# Altium schematic sheet [07] - TRANSCEIVERS.SchDoc
size A4
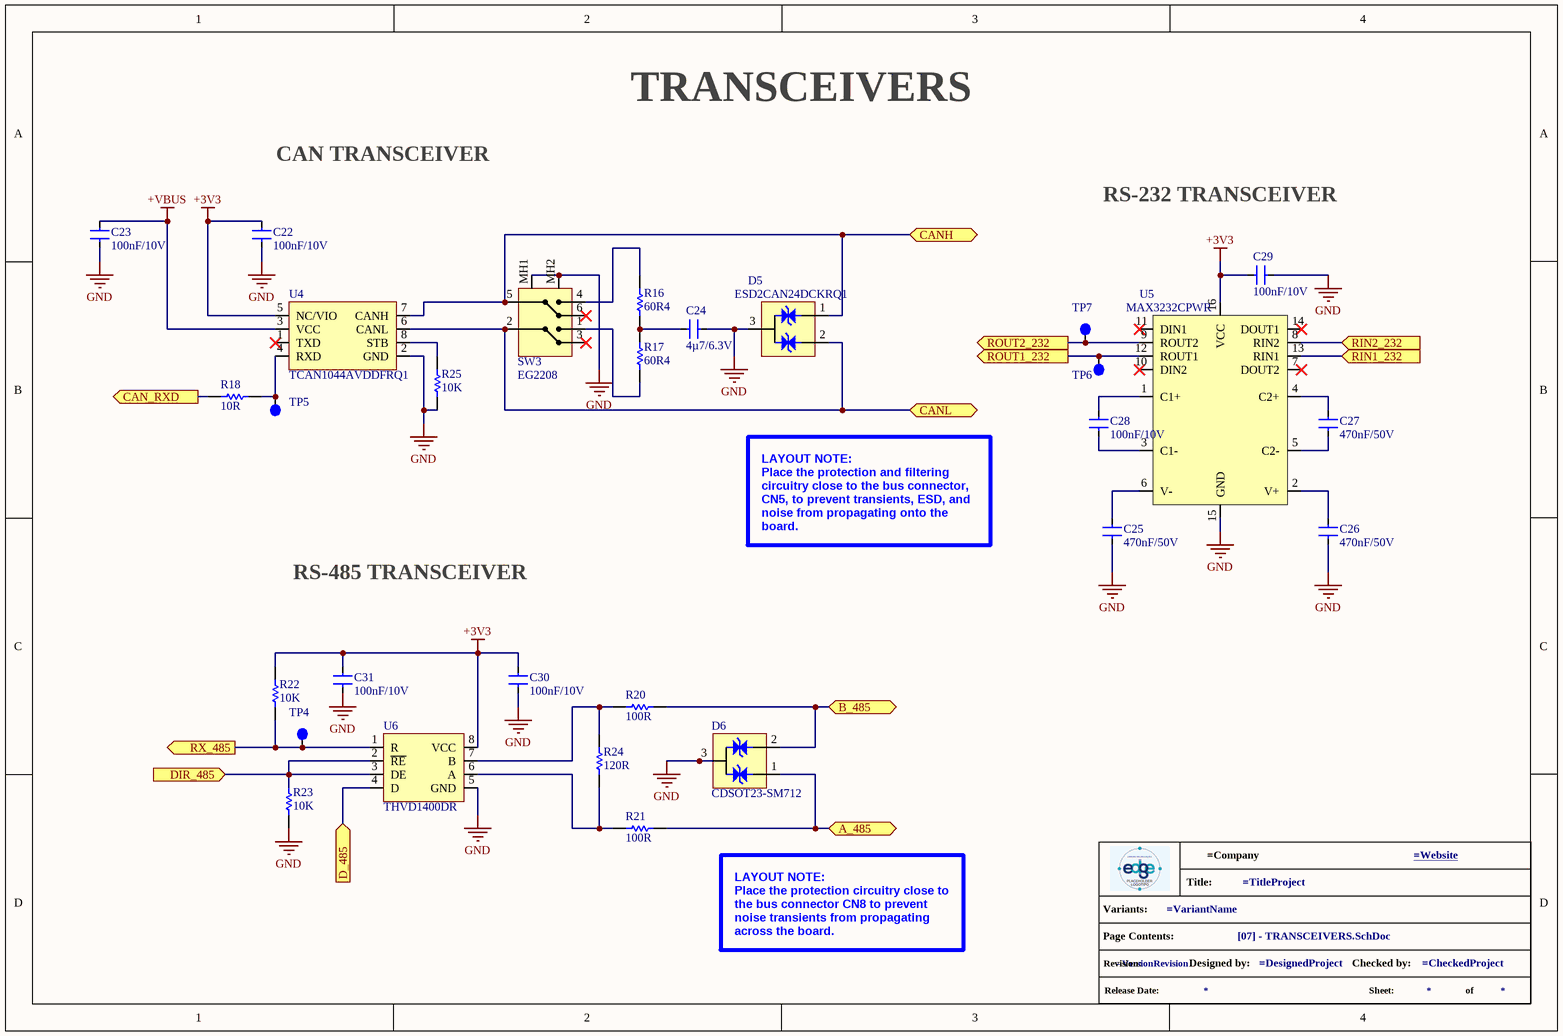
[diagram p0: [07] - TRANSCEIVERS.SchDoc]

## Parts
C22  100nF/10V  [C0402]
C23  100nF/10V  [C0402]
C24  4µ7/6.3V  [C0402]
C25  470nF/50V  [C0402]
C26  470nF/50V  [C0402]
C27  470nF/50V  [C0402]
C28  100nF/10V  [C0402]
C29  100nF/10V  [C0402]
C30  100nF/10V  [C0402]
C31  100nF/10V  [C0402]
D5  ESD2CAN24DCKRQ1  [ESD2CAN24DCKRQ1]
D6  CDSOT23-SM712  [CDSOT23-SM712]
GPH?  info_project  (value not drawn)  (graphical)
R16  60R4  [R0402]
R17  60R4  [R0402]
R18  10R  [R0402]
R20  100R  [R0603]
R21  100R  [R0603]
R22  10K  [R0402]
R23  10K  [R0402]
R24  120R  [R0402]
R25  10K  [R0402]
SW3  EG2208  [EG2208]
TP4  TestPoint  [Test Point]  (value not drawn)  (no BOM)
TP5  TestPoint  [Test Point]  (value not drawn)  (no BOM)
TP6  TestPoint  [Test Point]  (value not drawn)  (no BOM)
TP7  TestPoint  [Test Point]  (value not drawn)  (no BOM)
U4  TCAN1044AVDDFRQ1  [TCAN1044AVDDFRQ1]
U5  MAX3232CPWR  [MAX3232CPWR]
U6  THVD1400DR  [THVD1400DR]

## Ports
A_485 (bidir), B_485 (bidir), CAN_RXD (out), CANH (bidir), CANL (bidir), D_485 (in), DIR_485 (in), RIN1_232 (in), RIN2_232 (in), ROUT1_232 (out), ROUT2_232 (out), RX_485 (out)

## Nets
+3V3: C22.1 C29.2 C30.2 C31.2 R22.2 U4.5(NC/VIO) U5.16(VCC) U6.8(VCC)
+VBUS: C23.1 U4.3(VCC)
GND: C22.2 C23.2 C24.2 C25.1 C26.1 C29.1 C30.1 C31.1 D5.3(GND) D6.3(GND) R23.1 R25.1 SW3.MH1 SW3.MH2 U4.2(GND) U5.15(GND) U6.5(GND)
A_485: D6.1(IO_1) R21.2 ; port A_485
B_485: D6.2(IO_2) R20.2 ; port B_485
CAN_RXD: R18.1 ; port CAN_RXD
CANH: D5.1(IO_1) SW3.5(COM_2) U4.7(CANH) ; port CANH
CANL: D5.2(IO_2) SW3.2(COM_1) U4.6(CANL) ; port CANL
D_485: U6.4(D) ; port D_485
DIR_485: R23.2 U6.2(~{RE}) U6.3(DE) ; port DIR_485
RIN1_232: U5.13(RIN1) ; port RIN1_232
RIN2_232: U5.8(RIN2) ; port RIN2_232
ROUT1_232: TP6.1 U5.12(ROUT1) ; port ROUT1_232
ROUT2_232: TP7.1 U5.9(ROUT2) ; port ROUT2_232
RX_485: R22.1 TP4.1 U6.1(R) ; port RX_485
NetC24_1: C24.1 R16.1 R17.2
NetC25_2: C25.2 U5.6(V-)
NetC26_2: C26.2 U5.2(V+)
NetC27_1: C27.1 U5.5(C2-)
NetC27_2: C27.2 U5.4(C2+)
NetC28_1: C28.1 U5.3(C1-)
NetC28_2: C28.2 U5.1(C1+)
NetR16_2: R16.2 SW3.4
NetR17_1: R17.1 SW3.1
NetR18_2: R18.2 TP5.1 U4.4(RXD)
NetR20_1: R20.1 R24.2 U6.7(B)
NetR21_1: R21.1 R24.1 U6.6(A)
NetR25_2: R25.2 U4.8(STB)

Not connected (* = marked no-connect by the designer): SW3 3* 6*; U4 1(TXD)*; U5 7(DOUT2)* 10(DIN2)* 11(DIN1)* 14(DOUT1)*

## Notes on the sheet
- TRANSCEIVERS
- CAN TRANSCEIVER
- RS-232 TRANSCEIVER
- RS-485 TRANSCEIVER
- LAYOUT NOTE:
  Place the protection and filtering circuitry close to the bus connector, CN5, to prevent transients, ESD, and noise from propagating onto the board.
- LAYOUT NOTE:
  Place the protection circuitry close to the bus connector CN8 to prevent noise transients from propagating across the board.
- (in symbol info_project) Title:; Variants:; Page Contents:; Revision:; Designed by:; Checked by:; Release Date:; Sheet:; of

## Library data of the parts
C22 C23 C28-C31 = CL05B104KP5NNNC: MLCC - 100nF 10V X7R 0402 ±10% Ceramic Capacitor; Manufacturer 1: Samsung; Multilayer: Yes; .Mounting: SMT; Supplier: Digikey; Supplier Part Number: 1276-1002-1-ND; RoHS: Yes; Category: Ceramic Capacitors; Stock: 29591550; Pricing: 1=0,08, 10=0,004, 100=0,0036, 1000=0,0032 (USD); Mounting Technology: Surface Mount; Pins: 2; Dielectric Material: Ceramic; Package Shape: Rectangular; Case/Package: 0402; Terminal Finish: Nickel; Min Operating Temperature: -55°C; Max Operating Temperature: 125°C; JESD-609 Code: e3; Value: 100nF; Capacitor Type: Ceramic; Tolerance  (fill in as +-): 10%; Package Style: SMTMeter; Packaging: Tape and Reel; Tolerance (fill in as +-): 10%; Rated DC Voltage (URdc): 10V; Temperature Characteristics Code: X7R; Termination: Wraparound; Length: 1mm; Width: 0.5mm; Height: 0.5mm; Reach SVHC Compliant: Yes; RoHS Compliant: Yes; ComponentLink1URL: https://datasheet.ciiva.com:443/pdfs/VipMasterIC/IC/SEMS/SEMS-S-A0008523115/SEMS-S-A0008523129-1.pdf?src-supplier=IHS+Markit; ComponentLink1Description: https://datasheet.ciiva.com:443/pdfs/VipMasterIC/IC/SEMS/SEMS-S-A0008523115/SEMS-S-A0008523129-1.pdf?src-supplier=IHS+Markit; ComponentLink2URL: https://datasheet.ciiva.com/15165/getdatasheetpartid-37100-15165107.pdf?src-supplier=Verical; ComponentLink2Description: https://datasheet.ciiva.com/15165/getdatasheetpartid-37100-15165107.pdf?src-supplier=Verical; ComponentLink3URL: https://datasheet.ciiva.com/16498/cl05b104kq5nnnc-16498491.pdf?src-supplier=Future+Electronics; ComponentLink3Description: https://datasheet.ciiva.com/16498/cl05b104kq5nnnc-16498491.pdf?src-supplier=Future+Electronics; .PCBChecked: *; .SCHChecked: *; Manufacturer Part Number 1: CL05B104KP5NNNC
C24 = CL05A475KQ5NRNC: MLCC - 4.7 µF 6.3V 0402 X5R ±10%  Ceramic Capacitor X5R; Manufacturer 1: Samsung; Value: 4.7uF; Multilayer: Yes; .Mounting: SMT; Supplier: Digikey; Supplier Part Number: 1276-1481-1-ND; RoHS: Yes; Category: Ceramic Capacitors; Stock: 761086; Pricing: 1=0,08, 10=0,026, 100=0,016, 1000=0,0112, 2500=0,0096 (USD); Mounting Technology: Surface Mount; Pins: 2; Dielectric Material: Ceramic; Package Shape: Rectangular; Case/Package: 0402; Terminal Finish: Nickel; Min Operating Temperature: -55°C; Max Operating Temperature: 85°C; JESD-609 Code: e3; Capacitor Type: Ceramic; Tolerance  (fill in as +-): 10%; Packaging: Tape and Reel; Tolerance (fill in as +-): 10%; Rated DC Voltage (URdc): 6.3V; Temperature Characteristics Code: X5R; Termination: Wraparound; Reach SVHC Compliant: Yes; RoHS Compliant: Yes; ComponentLink1URL: https://datasheet.ciiva.com:443/pdfs/VipMasterIC/IC/SEMS/SEMS-S-A0008521219/SEMS-S-A0008521124-1.pdf?src-supplier=IHS+Markit; ComponentLink1Description: https://datasheet.ciiva.com:443/pdfs/VipMasterIC/IC/SEMS/SEMS-S-A0008521219/SEMS-S-A0008521124-1.pdf?src-supplier=IHS+Markit; ComponentLink2URL: https://datasheet.ciiva.com/25793/cl05a475kq5nrnc-25793634.pdf?src-supplier=Digikey; ComponentLink2Description: https://datasheet.ciiva.com/25793/cl05a475kq5nrnc-25793634.pdf?src-supplier=Digikey; ComponentLink3URL: https://datasheet.ciiva.com/26838/getdatasheetpartid-353228-26838196.pdf?src-supplier=Verical; ComponentLink3Description: https://datasheet.ciiva.com/26838/getdatasheetpartid-353228-26838196.pdf?src-supplier=Verical; .PCBChecked: *; .SCHChecked: *; Manufacturer Part Number 1: CL05A475KQ5NRNC
C25-C27 = GRM155R61H474KE11D: MLCC - 480nF 50V X5R 0402  ±10%  Ceramic Capacitor; Manufacturer 1: Murata; Value: 470nF; Multilayer: Yes; .Mounting: SMT; Supplier: Digikey; Supplier Part Number: 490-16354-1-ND; RoHS: Yes; Category: Ceramic Capacitors; Stock: 147570; Pricing: 1=0,1, 10=0,051, 100=0,0304, 1000=0,01969, 2500=0,01739, 5000=0,01546 (USD); Mounting Technology: Surface Mount; Pins: 2; Dielectric Material: Ceramic; Package Shape: Rectangular; Case/Package: 0402; Terminal Finish: Tin; Min Operating Temperature: -55°C; Max Operating Temperature: 85°C; JESD-609 Code: e3; Capacitor Type: Ceramic; Tolerance  (fill in as +-): 10%; Packaging: Tape and Reel; Tolerance (fill in as +-): 10%; Rated DC Voltage (URdc): 50V; Temperature Characteristics Code: X5R; Termination: Wraparound; Reach SVHC Compliant: Yes; RoHS Compliant: Yes; ComponentLink1URL: https://datasheet.ciiva.com:443/pdfs/VipMasterIC/IC/MURE/MURE-S-A0004362469/MURE-S-A0004364779-1.pdf?src-supplier=IHS+Markit; ComponentLink1Description: https://datasheet.ciiva.com:443/pdfs/VipMasterIC/IC/MURE/MURE-S-A0004362469/MURE-S-A0004364779-1.pdf?src-supplier=IHS+Markit; ComponentLink2URL: http://search.murata.co.jp/Ceramy/image/img/A01X/G101/ENG/GRM155R61H474KE11-01.pdf?src-supplier=Digikey; ComponentLink2Description: http://search.murata.co.jp/Ceramy/image/img/A01X/G101/ENG/GRM155R61H474KE11-01.pdf?src-supplier=Digikey; ComponentLink3URL: https://datasheet.octopart.com/GRM155R61H474KE11D-Murata-datasheet-99353828.pdf?src-supplier=Future+Electronics; ComponentLink3Description: https://datasheet.octopart.com/GRM155R61H474KE11D-Murata-datasheet-99353828.pdf?src-supplier=Future+Electronics; .PCBChecked: *; .SCHChecked: *; Manufacturer Part Number 1: GRM155R61H474KE11D
D5 = ESD2CAN24DCKRQ1: DIODE - TVS CLAMP - 37V (Typ) Clamp 5.7A (8/20µs) Ipp Tvs Diode Surface Mount SC-70-3; Manufacturer 1: Texas Instruments; .Mounting: SMT; Datasheet Link: https://www.ti.com/lit/ds/symlink/esd2can24-q1.pdf?ts=1669637432096&ref_url=https%253A%252F%252Fwww.ti.com%252Fproduct%252FESD2CAN24-Q1; Height: 1.1mm; Mouser Part Number: 595-ESD2CAN24DCKRQ1; Mouser Price/Stock: https://www.mouser.co.uk/ProductDetail/Texas-Instruments/ESD2CAN24DCKRQ1?qs=Y0Uzf4wQF3mF7ctB4rszMA%3D%3D; Arrow Part Number: ESD2CAN24DCKRQ1; Arrow Price/Stock: https://www.arrow.com/en/products/esd2can24dckrq1/texas-instruments?utm_currency=USD&region=nac; .PCBChecked: *; .SCHChecked: *; Manufacturer Part Number 1: ESD2CAN24DCKRQ1
D6 = CDSOT23-SM712: DIODE - TVS CLAMP 26V, 14V Clamp 17A (8/20µs) Ipp Tvs Diode Surface Mount SOT-23-3; Manufacturer 1: Bourns; .Mounting: SMT; Datasheet Link: http://uk.rs-online.com/web/p/products/7673728; Height: 1.17mm; Mouser Part Number: 652-CDSOT23-SM712; Mouser Price/Stock: https://www.mouser.co.uk/ProductDetail/Bourns/CDSOT23-SM712?qs=FuI%252BOVLl4%2FLTY%2FGQ265RLA%3D%3D; Arrow Part Number: CDSOT23-SM712; Arrow Price/Stock: https://www.arrow.com/en/products/cdsot23-sm712/bourns?utm_currency=USD&region=nac; .PCBChecked: *; .SCHChecked: *; Manufacturer Part Number 1: CDSOT23-SM712
GPH? = info_project: GRAPHICAL - Info Project
R16 R17 = ERJ-2RKF60R4X: RES - 60R4  1/10W 0402  ±1%  Chip Resistor; Manufacturer 1: Panasonic; Power: 100mW; Rated Temperature: 70°C; Value: 60.4R; Working Voltage: 50V; Temperature Coefficient (ppm/Cel): 100; Package Height: 0.35mm; Package Length: 1mm; Package Width: 0.5mm; Reference Standard: AEC-Q200; .Mounting: SMT; Supplier: Digikey; Supplier Part Number: P60.4LCT-ND; RoHS: Yes; Category: Chip SMD Resistors; Stock: 175855; Pricing: 1=0,1, 10=0,028, 100=0,0138, 1000=0,00766, 2500=0,00632, 5000=0,00554 (USD); Mounting Technology: Surface Mount; Pins: 2; Package Shape: Rectangular; Case/Package: 0402; Terminal Finish: Nickel; Min Operating Temperature: -55°C; Max Operating Temperature: 155°C; Tolerance: 1%; JESD-609 Code: e3; Resistor Type: FIXED RESISTOR; Construction: Rectangular; Packaging: Tape and Reel; Technology: METAL GLAZE/THICK FILM; Termination: Wraparound; Reach SVHC Compliant: Yes; RoHS Compliant: Yes; ComponentLink1URL: https://datasheet.ciiva.com:443/pdfs/VipMasterIC/IC/PANA/PANA-S-A0009889626/PANA-S-A0009889626-1.pdf?src-supplier=IHS+Markit; ComponentLink1Description: https://datasheet.ciiva.com:443/pdfs/VipMasterIC/IC/PANA/PANA-S-A0009889626/PANA-S-A0009889626-1.pdf?src-supplier=IHS+Markit; ComponentLink2URL: https://datasheet.ciiva.com/9188/aoa0000ce2-9188454.pdf?src-supplier=Avnet; ComponentLink2Description: https://datasheet.ciiva.com/9188/aoa0000ce2-9188454.pdf?src-supplier=Avnet; ComponentLink3URL: https://datasheet.ciiva.com/9188/aoa0000ce2-9188457.pdf?src-supplier=Avnet; ComponentLink3Description: https://datasheet.ciiva.com/9188/aoa0000ce2-9188457.pdf?src-supplier=Avnet; ComponentLink4URL: https://datasheet.ciiva.com/16777/70260748-16777353.pdf?src-supplier=Allied+Electronics; ComponentLink4Description: https://datasheet.ciiva.com/16777/70260748-16777353.pdf?src-supplier=Allied+Electronics; ComponentLink5URL: https://datasheet.ciiva.com/16783/70260748-16783483.pdf?src-supplier=Allied+Electronics; ComponentLink5Description: https://datasheet.ciiva.com/16783/70260748-16783483.pdf?src-supplier=Allied+Electronics; ComponentLink6URL: https://datasheet.ciiva.com/7853/aoa0000ce2-7853695.pdf?src-supplier=Element14; ComponentLink6Description: https://datasheet.ciiva.com/7853/aoa0000ce2-7853695.pdf?src-supplier=Element14; ComponentLink7URL: https://datasheet.ciiva.com/46373/1678782-46373448.pdf?src-supplier=Element14; ComponentLink7Description: https://datasheet.ciiva.com/46373/1678782-46373448.pdf?src-supplier=Element14; ComponentLink8URL: https://datasheet.ciiva.com/46373/1678782-46373449.pdf?src-supplier=Element14; ComponentLink8Description: https://datasheet.ciiva.com/46373/1678782-46373449.pdf?src-supplier=Element14; ComponentLink9URL: https://datasheet.ciiva.com/22674/1678782-22674277.pdf?src-supplier=Element14; ComponentLink9Description: https://datasheet.ciiva.com/22674/1678782-22674277.pdf?src-supplier=Element14; .PCBChecked: *; .SCHChecked: *; Manufacturer Part Number 1: ERJ-2RKF60R4X
R18 = CRCW040210R0FKED: RES - 10R  1/16W 0402 ±1%  Chip Resistor; Manufacturer 1: Vishay; Power: 63mW; Working Voltage: 50V; Temperature Coefficient (ppm/Cel): 100; Rated Temperature: 70°C; Package Height: 0.35mm; Package Length: 1mm; Package Width: 0.5mm; Reference Standard: AEC-Q200; .Mounting: SMT; Supplier: Digikey; Supplier Part Number: 541-10.0LCT-ND; RoHS: Yes; Category: Chip SMD Resistors; Stock: 496296; Pricing: 1=0,1, 10=0,03, 100=0,0148, 1000=0,0084 (USD); Mounting Technology: Surface Mount; Pins: 2; Case/Package: 0402; Terminal Finish: Nickel; Package Shape: Rectangular; Min Operating Temperature: -55°C; Max Operating Temperature: 155°C; Tolerance: 1%; JESD-609 Code: e3; Resistor Type: FIXED RESISTOR; Construction: Chip; Packaging: Tape and Reel; Value: 10R; Technology: METAL GLAZE/THICK FILM; Termination: Wraparound; Reach SVHC Compliant: Yes; RoHS Compliant: Yes; ComponentLink1URL: https://datasheet.ciiva.com:443/pdfs/VipMasterIC/IC/VISH/VISH-S-A0007266705/VISH-S-A0007266705-1.pdf?src-supplier=IHS+Markit; ComponentLink1Description: https://datasheet.ciiva.com:443/pdfs/VipMasterIC/IC/VISH/VISH-S-A0007266705/VISH-S-A0007266705-1.pdf?src-supplier=IHS+Markit; ComponentLink2URL: https://datasheet.ciiva.com/2463/dcrcwe3-2463040.pdf?src-supplier=Digikey; ComponentLink2Description: https://datasheet.ciiva.com/2463/dcrcwe3-2463040.pdf?src-supplier=Digikey; ComponentLink3URL: https://datasheet.ciiva.com/2463/dcrcwe3-2463041.pdf?src-supplier=Digikey; ComponentLink3Description: https://datasheet.ciiva.com/2463/dcrcwe3-2463041.pdf?src-supplier=Digikey; ComponentLink4URL: https://datasheet.ciiva.com/2463/dcrcwe3-2463042.pdf?src-supplier=Digikey; ComponentLink4Description: https://datasheet.ciiva.com/2463/dcrcwe3-2463042.pdf?src-supplier=Digikey; ComponentLink5URL: https://datasheet.ciiva.com/8336/dcrcwe3-8336700.pdf?src-supplier=Avnet; ComponentLink5Description: https://datasheet.ciiva.com/8336/dcrcwe3-8336700.pdf?src-supplier=Avnet; ComponentLink6URL: https://datasheet.ciiva.com/16755/70201119-16755541.pdf?src-supplier=Allied+Electronics; ComponentLink6Description: https://datasheet.ciiva.com/16755/70201119-16755541.pdf?src-supplier=Allied+Electronics; ComponentLink7URL: https://datasheet.ciiva.com/16760/70201119-16760941.pdf?src-supplier=Allied+Electronics; ComponentLink7Description: https://datasheet.ciiva.com/16760/70201119-16760941.pdf?src-supplier=Allied+Electronics; Manufacturer Part Number 1: CRCW040210R0FKED; .PCBChecked: *; .SCHChecked: *
R20 R21 = CRCW0603100RJNEAHP: RES - 100R  1/3W 0603 (1608 Metric) ±5%; Manufacturer 1: Vishay Dale; Power: 250mW; Rated Temperature: 70°C; Working Voltage: 75V; Temperature Coefficient (ppm/Cel): 200; Package Height: 0.45mm; Package Length: 1.6mm; Package Width: 0.85mm; Reference Standard: AEC-Q200; .Mounting: SMT; Supplier: Digikey; Supplier Part Number: 541-100SACT-ND; RoHS: Yes; Category: Chip SMD Resistors; Stock: 18342; Pricing: 1=0,14, 10=0,07, 50=0,0458, 100=0,0388, 500=0,02794, 1000=0,0248 (USD); Mounting Technology: Surface Mount; Pins: 2; Package Shape: Rectangular; Case/Package: 0603; Terminal Finish: Nickel; Min Operating Temperature: -55°C; Max Operating Temperature: 155°C; Tolerance: 5%; JESD-609 Code: e3; Resistor Type: FIXED RESISTOR; Construction: Chip; Packaging: Tape and Reel; Value: 100R; Technology: METAL GLAZE/THICK FILM; Termination: Wraparound; Reach SVHC Compliant: Yes; RoHS Compliant: Yes; ComponentLink1URL: https://datasheet.ciiva.com:443/pdfs/VipMasterIC/IC/VISH/VISH-S-A0009391795/VISH-S-A0009391795-1.pdf?src-supplier=IHS+Markit; ComponentLink1Description: https://datasheet.ciiva.com:443/pdfs/VipMasterIC/IC/VISH/VISH-S-A0009391795/VISH-S-A0009391795-1.pdf?src-supplier=IHS+Markit; ComponentLink2URL: https://datasheet.ciiva.com/8979/crcwhpe3-8979829.pdf?src-supplier=Avnet; ComponentLink2Description: https://datasheet.ciiva.com/8979/crcwhpe3-8979829.pdf?src-supplier=Avnet; ComponentLink3URL: https://datasheet.ciiva.com/5562/crcwhpe3-46056-5562229.pdf?src-supplier=Mouser; ComponentLink3Description: https://datasheet.ciiva.com/5562/crcwhpe3-46056-5562229.pdf?src-supplier=Mouser; .PCBChecked: *; .SCHChecked: *; Manufacturer Part Number 1: CRCW0603100RJNEAHP
R22 R23 R25 = RC1005F103CS: RES - 10K 1/16W 0402 ±1% Chip Resistor; Manufacturer 1: Samsung; Power: 60mW; Value: 10kR; Working Voltage: 50V; Temperature Coefficient (ppm/Cel): 100; Package Height: 0.35mm; Package Length: 1mm; Package Width: 0.5mm; .Mounting: SMT; Supplier: Digikey; Supplier Part Number: 1276-3431-1-ND; RoHS: Yes; Category: Chip SMD Resistors; Stock: 10935408; Pricing: 1=0,1, 10=0,039, 100=0,0201, 1000=0,01175, 2500=0,0099, 5000=0,00882 (USD); Mounting Technology: Surface Mount; Pins: 2; Package Shape: Rectangular; Case/Package: 0402; Terminal Finish: Nickel; Min Operating Temperature: -55°C; Max Operating Temperature: 125°C; Tolerance: 1%; JESD-609 Code: e3; Resistor Type: FIXED RESISTOR; Construction: Chip; Packaging: Tape and Reel; Technology: METAL GLAZE/THICK FILM; Reach SVHC Compliant: Yes; RoHS Compliant: Yes; ComponentLink1URL: https://datasheet.ciiva.com:443/pdfs/VipMasterIC/IC/SEMS/SEMS-S-A0001326806/SEMS-S-A0001326806-1.pdf?src-supplier=IHS+Markit; ComponentLink1Description: https://datasheet.ciiva.com:443/pdfs/VipMasterIC/IC/SEMS/SEMS-S-A0001326806/SEMS-S-A0001326806-1.pdf?src-supplier=IHS+Markit; ComponentLink2URL: https://datasheet.ciiva.com/15196/getdatasheetpartid-504789-15196214.pdf?src-supplier=Verical; ComponentLink2Description: https://datasheet.ciiva.com/15196/getdatasheetpartid-504789-15196214.pdf?src-supplier=Verical; ComponentLink3URL: https://datasheet.ciiva.com/16481/rcseries-16481007.pdf?src-supplier=Future+Electronics; ComponentLink3Description: https://datasheet.ciiva.com/16481/rcseries-16481007.pdf?src-supplier=Future+Electronics; .PCBChecked: *; .SCHChecked: *; Manufacturer Part Number 1: RC1005F103CS
R24 = ERA-2AEB121X: RES - 120R  1/16W  0402  ±0.1% Chip Resistor; Manufacturer 1: Panasonic; Power: 63mW; Rated Temperature: 85°C; Working Voltage: 25V; Temperature Coefficient (ppm/Cel): 25; Package Height: 0.35mm; Package Length: 1mm; Package Width: 0.5mm; Reference Standard: AEC-Q200; .Mounting: SMT; Supplier: Digikey; Supplier Part Number: P120DCCT-ND; RoHS: Yes; Category: Chip SMD Resistors; Stock: 44539; Pricing: 1=0,1, 10=0,082, 50=0,0716, 100=0,0677, 500=0,05944, 1000=0,05637, 5000=0,05076, 10000=0,05153, 20000=0,04948, 30000=0,04884, 50000=0,04563 (USD); Mounting Technology: Surface Mount; Pins: 2; Case/Package: 0402; Terminal Finish: Nickel; Min Operating Temperature: -55°C; Max Operating Temperature: 155°C; Tolerance: 0.1%; JESD-609 Code: e3; Termination: Wraparound; Resistor Type: FIXED RESISTOR; Construction: Rectangular; Packaging: Tape and Reel; Value: 120R; Technology: THIN FILM; Reach SVHC Compliant: Yes; RoHS Compliant: Yes; ComponentLink1URL: https://datasheet.ciiva.com:443/pdfs/VipMasterIC/IC/PANA/PANA-S-A0009459258/PANA-S-A0009459258-1.pdf?src-supplier=IHS+Markit; ComponentLink1Description: https://datasheet.ciiva.com:443/pdfs/VipMasterIC/IC/PANA/PANA-S-A0009459258/PANA-S-A0009459258-1.pdf?src-supplier=IHS+Markit; ComponentLink2URL: https://datasheet.ciiva.com/22737/1776116-22737243.pdf?src-supplier=Element14; ComponentLink2Description: https://datasheet.ciiva.com/22737/1776116-22737243.pdf?src-supplier=Element14; ComponentLink3URL: https://datasheet.ciiva.com/22737/1776116-22737244.pdf?src-supplier=Element14; ComponentLink3Description: https://datasheet.ciiva.com/22737/1776116-22737244.pdf?src-supplier=Element14; ComponentLink4URL: https://datasheet.ciiva.com/24024/aoa0000ce26-197354-24024678.pdf?src-supplier=Mouser; ComponentLink4Description: https://datasheet.ciiva.com/24024/aoa0000ce26-197354-24024678.pdf?src-supplier=Mouser; ComponentLink5URL: https://datasheet.ciiva.com/25720/1776116-25720558.pdf?src-supplier=Farnell; ComponentLink5Description: https://datasheet.ciiva.com/25720/1776116-25720558.pdf?src-supplier=Farnell; ComponentLink6URL: https://datasheet.ciiva.com/9186/aoa0000ce26-9186151.pdf?src-supplier=Avnet; ComponentLink6Description: https://datasheet.ciiva.com/9186/aoa0000ce26-9186151.pdf?src-supplier=Avnet; ComponentLink7URL: https://datasheet.ciiva.com/30070/54aoa0000ce26-30070076.pdf?src-supplier=Onlinecomponents.com; ComponentLink7Description: https://datasheet.ciiva.com/30070/54aoa0000ce26-30070076.pdf?src-supplier=Onlinecomponents.com; .SCHChecked: *; .PCBChecked: *; Manufacturer Part Number 1: ERA-2AEB121X
SW3 = EG2208: SWITCH - Slide Switch DPDT Through Hole, Right Angle; Manufacturer 1: E-Switch; .Mounting: PTH; Datasheet Link: https://configured-product-images.s3.amazonaws.com/2D/specs/EG2208.pdf; Height: 5mm; Manufacturer Part Number 1: EG2208; Mouser Part Number: 612-EG2208; Mouser Price/Stock: https://www.mouser.co.uk/ProductDetail/E-Switch/EG2208?qs=xDsBkp9LkodhU1lD9QrRVw%3D%3D; .SCHChecked: *; .PCBChecked: *
TP4-TP7 = Test_Point: MECH - Test Points
U4 = TCAN1044AVDDFRQ1: IC - Transceiver Half CANbus TSOT-23-8; Manufacturer 1: Texas Instruments; .Mounting: SMT; Datasheet Link: https://www.ti.com/lit/gpn/tcan1044av-q1; Height: 1.1mm; Mouser Part Number: 595-TCAN1044AVDDFRQ1; Mouser Price/Stock: https://www.mouser.co.uk/ProductDetail/Texas-Instruments/TCAN1044AVDDFRQ1?qs=7D1LtPJG0i2h5Rps6Zy%2FQg%3D%3D; Arrow Part Number: TCAN1044AVDDFRQ1; Arrow Price/Stock: https://www.arrow.com/en/products/tcan1044avddfrq1/texas-instruments?utm_currency=USD&region=europe; .PCBChecked: *; .SCHChecked: *; Manufacturer Part Number 1: TCAN1044AVDDFRQ1
U5 = MAX3232CPWR: IC - Transceiver Full-Duplex RS232 2-Channel, Data Rate 250kbps 16-TSSOP.; Manufacturer 1: Texas Instruments; Number of Receivers: 2; Logic Function: Transceiver,Receiver; Number of Transceivers: 1; Simplex/Duplex: Full Duplex; Receiver Hysteresis: 300mV; Supply Current: 1mA; Max Supply Voltage: 5.5V; Min Supply Voltage: 3V; Operating Supply Voltage: 5V; Supply Type: Single; Description 1: 3- to 5.5-V dual channel 250kbps RS-232 line driver/receiver with +/-15-kV ESD protection 16-TSSOP 0 to 70; Category 1: RS-232 / RS-422 / RS-485 Interface ICs; .Mounting: SMT; Mounting Technology: Surface Mount; Case/Package: TSSOP; Pins: 16; Weight: 0.002183oz; Min Operating Temperature: -40°C; Max Operating Temperature: 85°C; Package Quantity: 2000; Packaging: Tape and Reel; Data Rate: 250Kbps; Number of Transmitters: 2; Number of Drivers: 2; Series: -; Number of Channels: 2; Operating Supply Current: 1mA; Termination: SMD/SMT; Length: 5mm; Width: 4.4mm; Height: 1mm; Radiation Hardening: No; Lead Free: Lead Free; RoHS Compliant: Yes; Reach SVHC Compliant: No; ComponentLink1URL: https://datasheet.ciiva.com/22694/1823586-22694378.pdf?src-supplier=Element14; ComponentLink1Description: https://datasheet.ciiva.com/22694/1823586-22694378.pdf?src-supplier=Element14; ComponentLink2URL: https://datasheet.ciiva.com/8064/1823586-8064567.pdf?src-supplier=Element14; ComponentLink2Description: https://datasheet.ciiva.com/8064/1823586-8064567.pdf?src-supplier=Element14; ComponentLink3URL: https://datasheet.ciiva.com/46394/1882754-46394522.pdf?src-supplier=Element14; ComponentLink3Description: https://datasheet.ciiva.com/46394/1882754-46394522.pdf?src-supplier=Element14; ComponentLink4URL: https://datasheet.ciiva.com/46397/1882754-46397997.pdf?src-supplier=Element14; ComponentLink4Description: https://datasheet.ciiva.com/46397/1882754-46397997.pdf?src-supplier=Element14; ComponentLink5URL: https://datasheet.ciiva.com/1702/max3232-1702785.pdf?src-supplier=Digi-Key; ComponentLink5Description: https://datasheet.ciiva.com/1702/max3232-1702785.pdf?src-supplier=Digi-Key; ComponentLink6URL: https://datasheet.ciiva.com/1702/max3232-1702784.pdf?src-supplier=Digi-Key; ComponentLink6Description: https://datasheet.ciiva.com/1702/max3232-1702784.pdf?src-supplier=Digi-Key; ComponentLink7URL: https://datasheet.ciiva.com/1702/max3232-1702786.pdf?src-supplier=Digi-Key; ComponentLink7Description: https://datasheet.ciiva.com/1702/max3232-1702786.pdf?src-supplier=Digi-Key; Manufacturer Part Number 1: MAX3232CPWR; RoHS 1: Yes; Stock 1: 15299; Pricing 1: 1=0,99, 10=0,849, 50=0,849, 100=0,652, 1000=0,454, 10000=0,387 (USD); Manufacturer 2: Texas Instruments; Manufacturer Part Number 2: MAX3232IPWR; Manufacturer 3: Texas Instruments; Manufacturer Part Number 3: MAX3232ECPWR; .PCBChecked: *; .SCHChecked: *; Supplier 1: Digikey; Supplier Part Number 1: 296-13096-1-ND
U6 = THVD1400DR: IC - Transceiver Half RS422, RS485 8-SOIC; Manufacturer 1: Texas Instruments; .Mounting: SMT; Datasheet Link: https://www.arrow.com/en/products/thvd1400dr/texas-instruments; Height: 1.75mm; Mouser Part Number: 595-THVD1400DR; Mouser Price/Stock: https://www.mouser.co.uk/ProductDetail/Texas-Instruments/THVD1400DR?qs=eP2BKZSCXI7bzZdDjIHgHQ%3D%3D; Arrow Part Number: THVD1400DR; Arrow Price/Stock: https://www.arrow.com/en/products/thvd1400dr/texas-instruments?utm_currency=USD&region=nac; .PCBChecked: *; .SCHChecked: *; Manufacturer Part Number 1: THVD1400DR